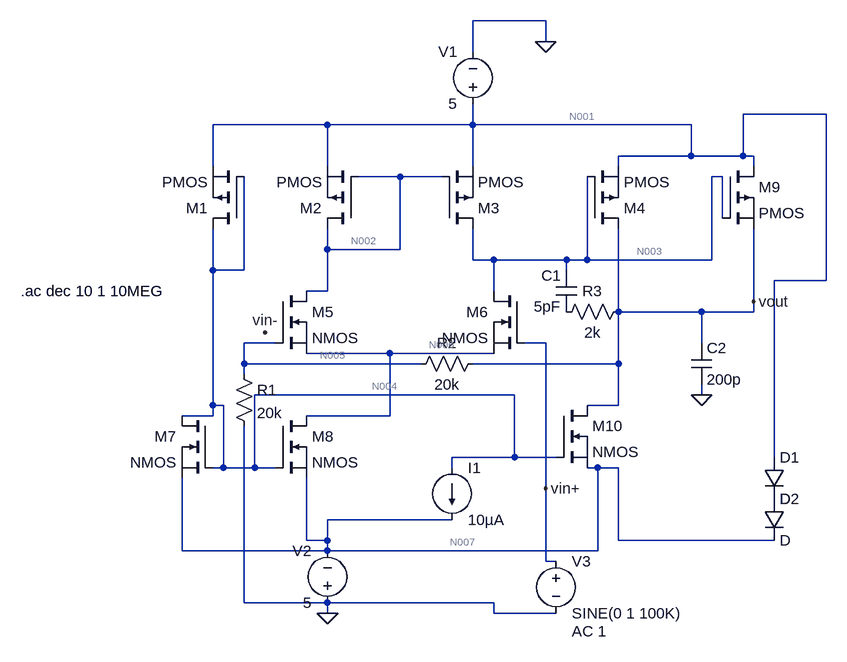
[diagram p0: schematic Diodemiller.asc]
Diodemiller.asc, the LTspice schematic file:
Version 4.1
SHEET 1 916 680
WIRE 480 -416 368 -416
WIRE 480 -384 480 -416
WIRE 368 -368 368 -416
WIRE 912 -272 784 -272
WIRE 144 -256 -32 -256
WIRE 368 -256 368 -288
WIRE 368 -256 144 -256
WIRE 704 -256 368 -256
WIRE 704 -208 704 -256
WIRE 704 -208 592 -208
WIRE 784 -208 784 -272
WIRE 784 -208 704 -208
WIRE 800 -208 784 -208
WIRE -32 -192 -32 -256
WIRE 144 -192 144 -256
WIRE 368 -192 368 -256
WIRE 592 -192 592 -208
WIRE 800 -192 800 -208
WIRE 256 -176 192 -176
WIRE 320 -176 256 -176
WIRE 752 -176 736 -176
WIRE 752 -112 752 -176
WIRE 144 -64 144 -96
WIRE 256 -64 256 -176
WIRE 256 -64 144 -64
WIRE 368 -48 368 -96
WIRE 400 -48 368 -48
WIRE 512 -48 400 -48
WIRE 544 -48 544 -176
WIRE 544 -48 512 -48
WIRE 736 -48 736 -176
WIRE 736 -48 544 -48
WIRE -32 -32 -32 -96
WIRE 16 -32 16 -176
WIRE 16 -32 -32 -32
WIRE 512 -32 512 -48
WIRE 912 -16 912 -272
WIRE 912 -16 832 -16
WIRE 144 0 144 -64
WIRE 144 0 112 0
WIRE 400 0 400 -48
WIRE 800 16 800 -96
WIRE 592 32 592 -96
WIRE 720 32 592 32
WIRE 800 32 800 16
WIRE 800 32 720 32
WIRE 64 80 16 80
WIRE 480 80 448 80
WIRE 720 80 720 32
WIRE 240 96 112 96
WIRE 400 96 240 96
WIRE 16 112 16 80
WIRE 288 112 16 112
WIRE 592 112 592 32
WIRE 592 112 368 112
WIRE 16 128 16 112
WIRE 432 160 32 160
WIRE 720 160 720 144
WIRE -32 176 -32 -32
WIRE -16 176 -32 176
WIRE 592 176 592 112
WIRE 592 176 544 176
WIRE -32 192 -32 176
WIRE -32 192 -80 192
WIRE 240 192 240 96
WIRE 240 192 112 192
WIRE 432 256 432 160
WIRE 432 256 336 256
WIRE 496 256 432 256
WIRE 832 256 832 -16
WIRE -16 272 -16 176
WIRE -16 272 -32 272
WIRE 32 272 32 160
WIRE 32 272 -16 272
WIRE 64 272 32 272
WIRE 336 272 336 256
WIRE 560 272 544 272
WIRE 592 272 560 272
WIRE 480 304 480 80
WIRE 336 352 144 352
WIRE 112 384 112 288
WIRE 144 384 144 352
WIRE 144 384 112 384
WIRE 592 384 592 272
WIRE 832 384 592 384
WIRE -80 400 -80 288
WIRE 144 400 144 384
WIRE 144 400 -80 400
WIRE 560 400 560 272
WIRE 560 400 144 400
WIRE 480 416 480 304
WIRE 496 416 480 416
WIRE 16 480 16 208
WIRE 144 480 16 480
WIRE 400 480 144 480
WIRE 144 496 144 480
WIRE 400 496 400 480
WIRE 496 496 400 496
FLAG 480 -384 0
FLAG 144 496 0
FLAG 720 160 0
FLAG 800 16 vout
FLAG 480 304 vin+
FLAG 48 64 vin-
SYMBOL pmos 16 -96 R180
SYMATTR InstName M1
SYMBOL pmos 192 -96 R180
SYMATTR InstName M2
SYMBOL pmos 320 -96 M180
SYMATTR InstName M3
SYMBOL pmos 544 -96 M180
SYMATTR InstName M4
SYMBOL nmos 64 0 R0
SYMATTR InstName M5
SYMBOL nmos 448 0 M0
SYMATTR InstName M6
SYMBOL nmos -32 192 M0
SYMATTR InstName M7
SYMBOL nmos 64 192 R0
SYMATTR InstName M8
SYMBOL voltage 368 -272 R180
WINDOW 0 24 96 Left 2
WINDOW 3 24 16 Left 2
SYMATTR InstName V1
SYMATTR Value 5
SYMBOL res 0 112 R0
SYMATTR InstName R1
SYMATTR Value 20k
SYMBOL voltage 144 496 R180
WINDOW 0 24 96 Left 2
WINDOW 3 24 16 Left 2
SYMATTR InstName V2
SYMATTR Value 5
SYMBOL voltage 496 400 R0
WINDOW 123 24 124 Left 2
WINDOW 39 0 0 Left 0
SYMATTR Value2 AC 1
SYMATTR InstName V3
SYMATTR Value SINE(0 1 100K)
SYMBOL res 384 96 R90
WINDOW 0 0 56 VBottom 2
WINDOW 3 32 56 VTop 2
SYMATTR InstName R2
SYMATTR Value 20k
SYMBOL cap 528 -32 M0
SYMATTR InstName C1
SYMATTR Value 5pF
SYMBOL cap 704 80 R0
SYMATTR InstName C2
SYMATTR Value 200p
SYMBOL pmos 752 -192 R0
SYMATTR InstName M9
SYMBOL nmos 496 176 R0
SYMATTR InstName M10
SYMBOL res 608 16 R90
WINDOW 0 0 56 VBottom 2
WINDOW 3 32 56 VTop 2
SYMATTR InstName R3
SYMATTR Value 2k
SYMBOL diode 816 256 R0
SYMATTR InstName D1
SYMBOL diode 816 320 R0
SYMATTR InstName D2
SYMBOL current 336 272 R0
SYMATTR InstName I1
SYMATTR Value 10µA
TEXT -328 0 Left 2 !.ac dec 10 1 10MEG

The netlist it stands for:
* Diodemiller.asc
M1 N004 N004 N001 N001 PMOS
M2 N002 N002 N001 N001 PMOS
M3 N003 N002 N001 N001 PMOS
M4 vout N003 N001 N001 PMOS
M5 N002 N005 N006 N006 NMOS
M6 N003 vin+ N006 N006 NMOS
M7 N004 N004 N007 N007 NMOS
M8 N006 N004 N007 N007 NMOS
V1 N001 0 5
R1 N005 0 20k
V2 0 N007 5
V3 vin+ 0 SINE(0 1 100K) AC 1
R2 vout N005 20k
C1 N003 P001 5pF
C2 vout 0 200p
M9 N001 N003 vout vout PMOS
M10 vout N004 N007 N007 NMOS
R3 vout P001 2k
D1 N001 P002 D
D2 P002 N007 D
I1 N004 N007 10µA
.model D D
.lib standard.dio
.model NMOS NMOS
.model PMOS PMOS
.lib standard.mos
.ac dec 10 1 10MEG
.backanno
.end

* Results of the author's LTspice run, read from the files saved beside the schematic
* Operating Point, zero values left out:
*   V(n001) = 5 V
*   V(n002) = 954.9 mV
*   V(n003) = 4.447 V
*   V(n004) = -50 mV
*   V(n005) = 2.186 V
*   V(n006) = -2.042 V
*   V(n007) = -5 V
*   V(p001) = 4.372 V
*   V(vout) = 4.372 V
*   I(D1) = 3.572 TA
*   I(D2) = 3.572 TA
*   I(I1) = 10 µA
*   I(R1) = 109.3 µA
*   I(R2) = 109.3 µA
*   I(V1) = -3.572 TA
*   I(V2) = -3.572 TA
*   Ib(M1) = 5.06 pA
*   Ib(M10) = -9.382 pA
*   Ib(M2) = 4.055 pA
*   Ib(M5) = -3.007 pA
*   Ib(M6) = -6.499 pA
*   Ib(M7) = -4.96 pA
*   Ib(M8) = -2.968 pA
*   Ib(M9) = -348.2 µA
*   Id(M1) = -255 µA
*   Id(M10) = 245 µA
*   Id(M2) = -163.6 µA
*   Id(M3) = -41.71 µA
*   Id(M4) = -3.062 µA
*   Id(M5) = 163.6 µA
*   Id(M6) = 41.71 µA
*   Id(M7) = 245 µA
*   Id(M8) = 205.3 µA
*   Id(M9) = 351.3 µA
*   Is(M1) = 255 µA
*   Is(M10) = -245 µA
*   Is(M2) = 163.6 µA
*   Is(M3) = 41.71 µA
*   Is(M4) = 3.062 µA
*   Is(M5) = -163.6 µA
*   Is(M6) = -41.71 µA
*   Is(M7) = -245 µA
*   Is(M8) = -205.3 µA
*   Is(M9) = -3.062 µA
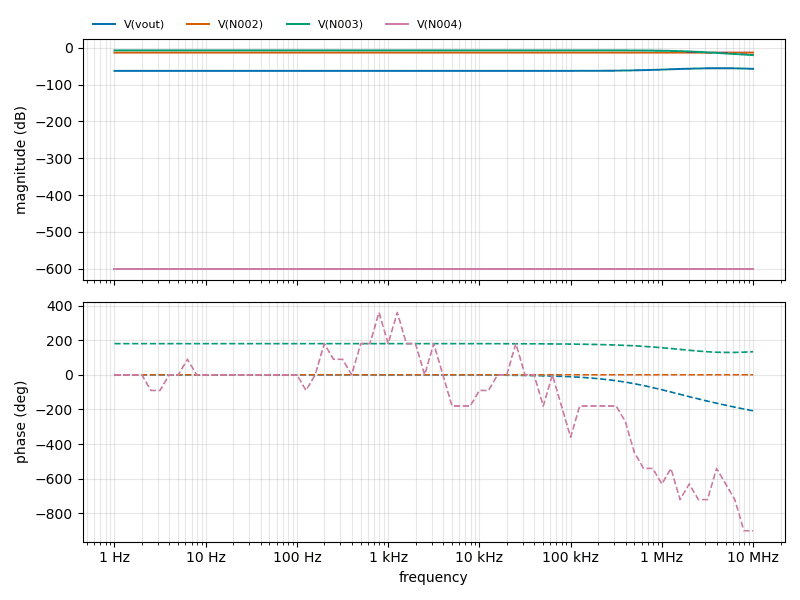
[diagram p1: AC Analysis of Diodemiller.asc, plotted from the saved traces]
* AC Analysis, 1 run:
*   V(vout): -62.51 dB at 1 Hz, -56.94 dB at 10 MHz, peak -55.45 dB at 3.981 MHz, 3 dB below the peak at 1.167 MHz
*   V(N002): -12.96 dB at 1 Hz, -12.95 dB at 10 MHz, peak -12.95 dB at 5.012 MHz
*   V(N003): -6.82 dB at 1 Hz, -19.64 dB at 10 MHz, peak -6.82 dB at 1 Hz, 3 dB below the peak at 1.971 MHz
*   V(N004): -600.00 dB at 1 Hz, -600.00 dB at 10 MHz, peak -600.00 dB at 1 Hz